# Altium schematic sheet Sheet2.SchDoc
size A4; SheetNumber: 2; SheetTotal: 2
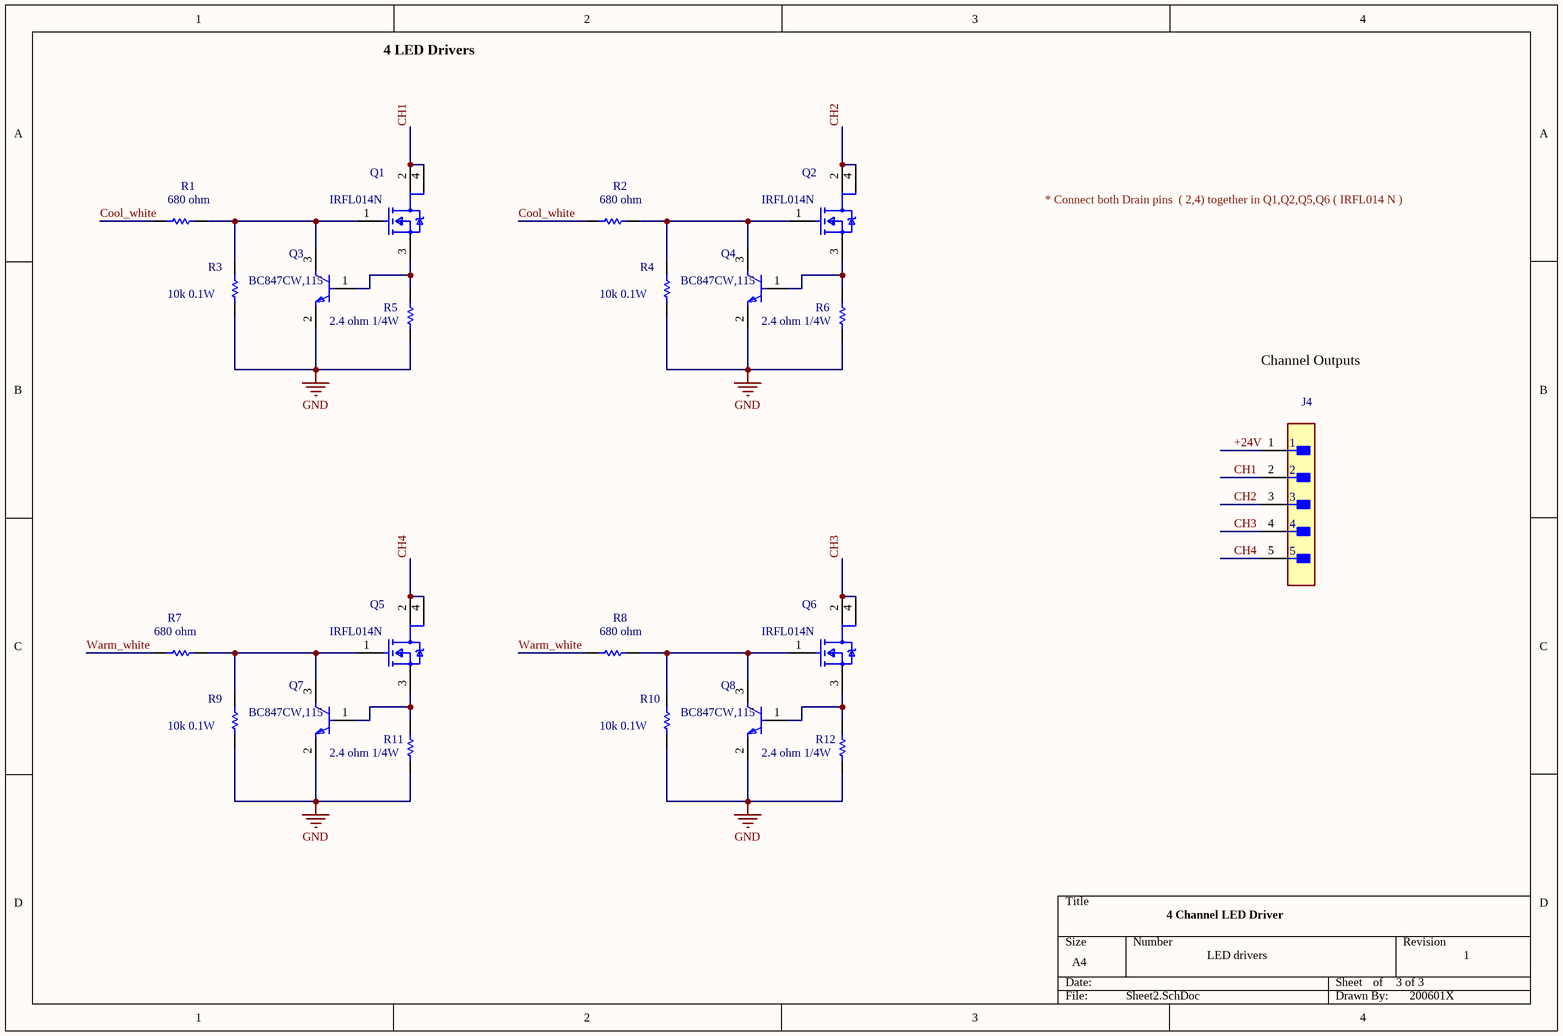
[diagram p0: Sheet2.SchDoc]

## Parts
J4  B5B-XH-AM(LF)(SN)  [FP-B5B-XH-AM_LF_SN-MFG]  (value not drawn)
Q1  IRFL014N  [FP-P-SOT223-3-MFG]
Q2  IRFL014N  [FP-P-SOT223-3-MFG]
Q3  BC847CW,115  [FP-SOT323-IPC_A]
Q4  BC847CW,115  [FP-SOT323-IPC_A]
Q5  IRFL014N  [FP-P-SOT223-3-MFG]
Q6  IRFL014N  [FP-P-SOT223-3-MFG]
Q7  BC847CW,115  [FP-SOT323-IPC_A]
Q8  BC847CW,115  [FP-SOT323-IPC_A]
R1  680 ohm  [RESC2013X50X30NL20T20]
R2  680 ohm  [RESC2013X50X30NL20T20]
R3  10k 0.1W  [RESC1609X50X30NL8T20]
R4  10k 0.1W  [RESC1609X50X30NL8T20]
R5  2.4 ohm 1/4W  [RESC3116X65X40LL10T20]
R6  2.4 ohm 1/4W  [RESC3116X65X40LL10T20]
R7  680 ohm  [RESC2013X50X30NL20T20]
R8  680 ohm  [RESC2013X50X30NL20T20]
R9  10k 0.1W  [RESC1609X50X30NL8T20]
R10  10k 0.1W  [RESC1609X50X30NL8T20]
R11  2.4 ohm 1/4W  [RESC3116X65X40LL10T20]
R12  2.4 ohm 1/4W  [RESC3116X65X40LL10T20]

## Nets
GND: Q3.2(E) Q4.2(E) Q7.2(E) Q8.2(E) R3.1 R4.1 R5.1 R6.1 R9.1 R10.1 R11.1 R12.1
+24V: J4.1
CH1: J4.2 Q1.2(DRAIN) Q1.4(DRAIN)
CH2: J4.3 Q2.2(DRAIN) Q2.4(DRAIN)
CH3: J4.4 Q6.2(DRAIN) Q6.4(DRAIN)
CH4: J4.5 Q5.2(DRAIN) Q5.4(DRAIN)
Cool_white: R1.1 R2.1
Warm_white: R7.1 R8.1
NetQ1_1: Q1.1(GATE) Q3.3(C) R1.2 R3.2
NetQ1_3: Q1.3(SOURCE) Q3.1(B) R5.2
NetQ2_1: Q2.1(GATE) Q4.3(C) R2.2 R4.2
NetQ2_3: Q2.3(SOURCE) Q4.1(B) R6.2
NetQ5_1: Q5.1(GATE) Q7.3(C) R7.2 R9.2
NetQ5_3: Q5.3(SOURCE) Q7.1(B) R11.2
NetQ6_1: Q6.1(GATE) Q8.3(C) R8.2 R10.2
NetQ6_3: Q6.3(SOURCE) Q8.1(B) R12.2

## Notes on the sheet
- 4 LED Drivers
- * Connect both Drain pins  ( 2,4) together in Q1,Q2,Q5,Q6 ( IRFL014 N )
- Channel Outputs
- 4 Channel LED Driver
- LED drivers
- 3 of 3
- 1
- 200601X

## Library data of the parts
J4 = CMP-17439-000304-1: CONN HEADER VERT 5POS 2.5MM; Mated Stacking Heights: 9.8mm; Voltage Rating: 250V; Max Current Rating: 3A; Number of Positions: 5; Contact Resistance: 20mR; Depth: 5.75mm; Connector Type: Header; Color: Green; Insulation Material: Nylon; Contact Plating: Copper; Length: 14.9mm; Fastening Type: Detent; Contact Material: Brass; Number of Rows: 1; Contact Type: Male Pin; Housing Material: Polyamide; Housing Color: White; Lead Free: Lead Free; Max Voltage Rating (AC): 250V; Mount: Through Hole; Contact Shape: Square; Min Operating Temperature: -25°C; Packaging: Bulk; Orientation: Straight; Insulation Color: Natural; Series: XH; Flammability Rating: UL94 V-0; Contact Finish - Mating: TIN; Max Operating Temperature: 85°C; Termination: Solder; Pitch: 2.5mm
Q1 Q2 Q5 Q6 = CMP-32901-000109-1: MOSFET N-CH 55V 1.9A SOT223; Manufacturer: Infineon; Obsolete Part: false; Manufacturer Part Number: IRFL014NTRPBF; Number Of N Channels: 1; Threshold Vgs Min: 2V; Reverse Recovery Charge: 64nC; Reverse Recovery Time: 41ns; Rthja Max: 120°C/W; Gate To Source Voltage: 20V; Turn Off Delay Time: 12ns; Max Forward Diode Voltage: 1V; Gate Charge At Vgs: 7nC @ 10V; Input Capacitace At Vds: 190pF @ 25V; Max Junction Temp: +150°C; Standoff Height: 0.061mm; Threshold Vgs Max: 4V; Power Dissipation: 1W; Drain To Source Resistance: 0.16Ω; Pulse Drain Current: 15A; Turn On Delay Time: 6.6ns; ComponentLink2Description: Datasheet; Drain To Source Voltage: 55V; Package: P-SOT223-3; Continuous Drain Current: 1.9A; Drain To Source Breakdown Voltage: 55V; Octopart: https://octopart.com/irfl014ntrpbf-infineon-65874001; Category: Trans; Footprint Url: https://www.infineon.com/dgdl/po-sot223.pdf?fileId=5546d462580663ef0158068bea690191; Device Class L2: Transistors; Automotive: No; Digikey Description: MOSFET N-CH 55V 1.9A SOT223; Number Of Channels: 1; Temperature: -55°C to +150°C; Ipc Land Pattern Name: SOT230P700X168-4; Temperature Range High: +150°C; ComponentLink2URL: https://www.infineon.com/dgdl/irfl014npbf.pdf?fileId=5546d462533600a401535627c5321fac; Temperature Range Low: -55°C; Device Class L3: MOSFETs; Device Class L1: Discrete Semiconductors; RoHS: TRUE; Height: 1.8mm; Depletion Mode: False; Lead Free: Yes
Q3 Q4 Q7 Q8 = CMP-14406-000045-1: TRANS NPN 45V 100MA SOT323; RoHS Compliant: Yes
R1 R2 R7 R8 = CMP-2001-04066-1: Manufacturer: Vishay Dale; Part Number: CRCW0805680RFKEA
R3 R4 R9 R10 = CMP-1666-00005-4: Chip Resistor, 10 KOhm, +/- 1%, 100 mW, -55 to 155 degC, 0603 (1608 Metric), RoHS, Tape and Reel; Manufacturer: Vishay Semiconductor; Voltage Rating: 75 V; Max Operating Temperature: 155 degC; PackageDescription: 2-Pin Surface Mount Device, Body 1.575 x 0.85 mm; ComponentLink1Description: Manufacturer URL; RoHSCompliant: true; PackageReference: 0603; REACH SVHC: Unknown; Length: 1.55 mm; DatasheetVersion: 06/2012; Packaging: Tape and Reel; Min Operating Temperature: -55 degC; Mounting Technology: Surface Mount; ComponentLink2URL: https://datasheet.ciiva.com/11809/0900766b80d98afc-11809037.pdf; Height: 0.45 mm; ComponentLink2Description: Datasheet; Package Quantity: 5000; ComponentLink1URL: http://www.vishay.com/
R5 R6 R11 R12 = CMP-2003-03693-1: Manufacturer: Yageo; Part Number: RC1206FR-072R4L